# EAGLE schematic freqdivider (EAGLE 6.4)
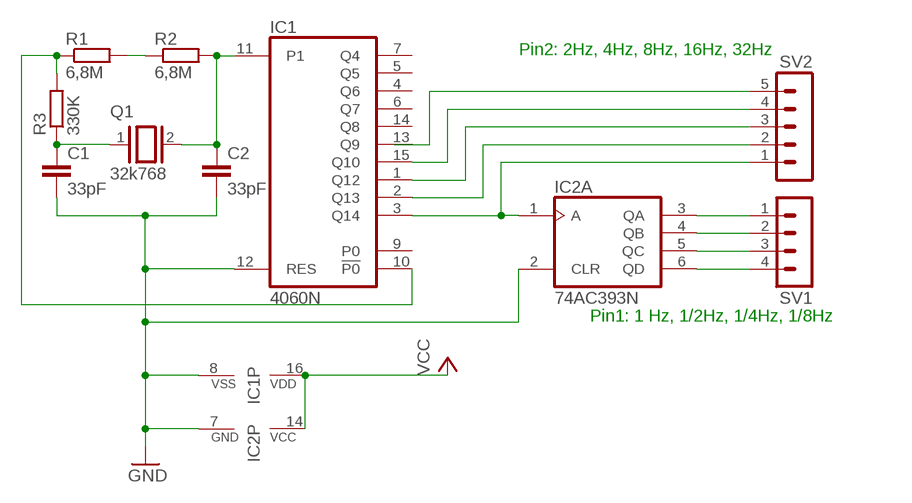
[diagram p0: schematic, sheet 1]

## Parts
C1  33pF  C-EU025-060X050  [C025-060X050]
C2  33pF  C-EU025-060X050  [C025-060X050]
IC1  4060N  [DIL16]
IC2  74AC393N  [DIL14]
Q1  32k768  XTAL  [Q]
R1  6,8M  R-EU_0207/10  [0207/10]
R2  6,8M  R-EU_0207/10  [0207/10]
R3  330K  R-EU_0207/10  [0207/10]
SV1  MA04-1  [MA04-1]
SV2  MA05-1  [MA05-1]

## Nets
GND: C1.2 C2.2 IC1.8(VSS) IC1.12(RES) IC2.2(A:CLR) IC2.7(P:GND)
N$1: R1.2 R2.1
N$2: IC1.10(!P0) R1.1 R3.2
N$3: C1.1 Q1.1 R3.1
N$4: C2.1 IC1.11(P1) Q1.2 R2.2
N$5: IC1.3(Q14) IC2.1(A:A) SV2.1
N$6: IC2.3(A:QA) SV1.1
N$7: IC2.4(A:QB) SV1.2
N$8: IC2.5(A:QC) SV1.3
N$9: IC2.6(A:QD) SV1.4
N$10: IC1.2(Q13) SV2.2
N$11: IC1.1(Q12) SV2.3
N$12: IC1.15(Q10) SV2.4
N$13: SV2.5
VCC: IC1.16(VDD) IC2.14(P:VCC)
Unconnected: IC1.4(Q6) IC1.5(Q5) IC1.6(Q7) IC1.7(Q4) IC1.9(P0) IC1.13(Q9) IC1.14(Q8) IC2.8(B:QD) IC2.9(B:QC) IC2.10(B:QB) IC2.11(B:QA) IC2.12(B:CLR) IC2.13(B:A)

## Notes on the sheet
- Pin2: 2Hz, 4Hz, 8Hz, 16Hz, 32Hz
- Pin1: 1 Hz, 1/2Hz, 1/4Hz, 1/8Hz

## Library data of the parts
C1 C2 = rcl:C-EU: CAPACITOR, European symbol
IC1 = 40xx:4060: 14-stage binary/ripple COUNTER
IC2 = 74xx-eu:74*393: Dual 4-bit decade and binary COUNTER
Q1 = special:XTAL: CRYSTAL
R1-R3 = rcl:R-EU_: RESISTOR, European symbol
SV1 = con-lstb:MA04-1: PIN HEADER; OC_FARNELL: unknown; OC_NEWARK: unknown
SV2 = con-lstb:MA05-1: PIN HEADER; OC_FARNELL: unknown; OC_NEWARK: unknown